# Altium schematic sheet 1_AIR_TEST.schdoc
size 309 x 223 mm; Symbol: Sheet-Symbol_A4; Device: Sheet-Symbol_A4; @Page Name: P1; @Create Date: 2023-04-03; @Page Count: 2; @Page No: 1; @Project Name: AIR_TestSys Design_2023-04-03_20-42-52; @Schematic Name: Schematic1; @Update Date: 2023-05-18; Company: 嘉立创EDA; Page Size: A4; Version: V1.0
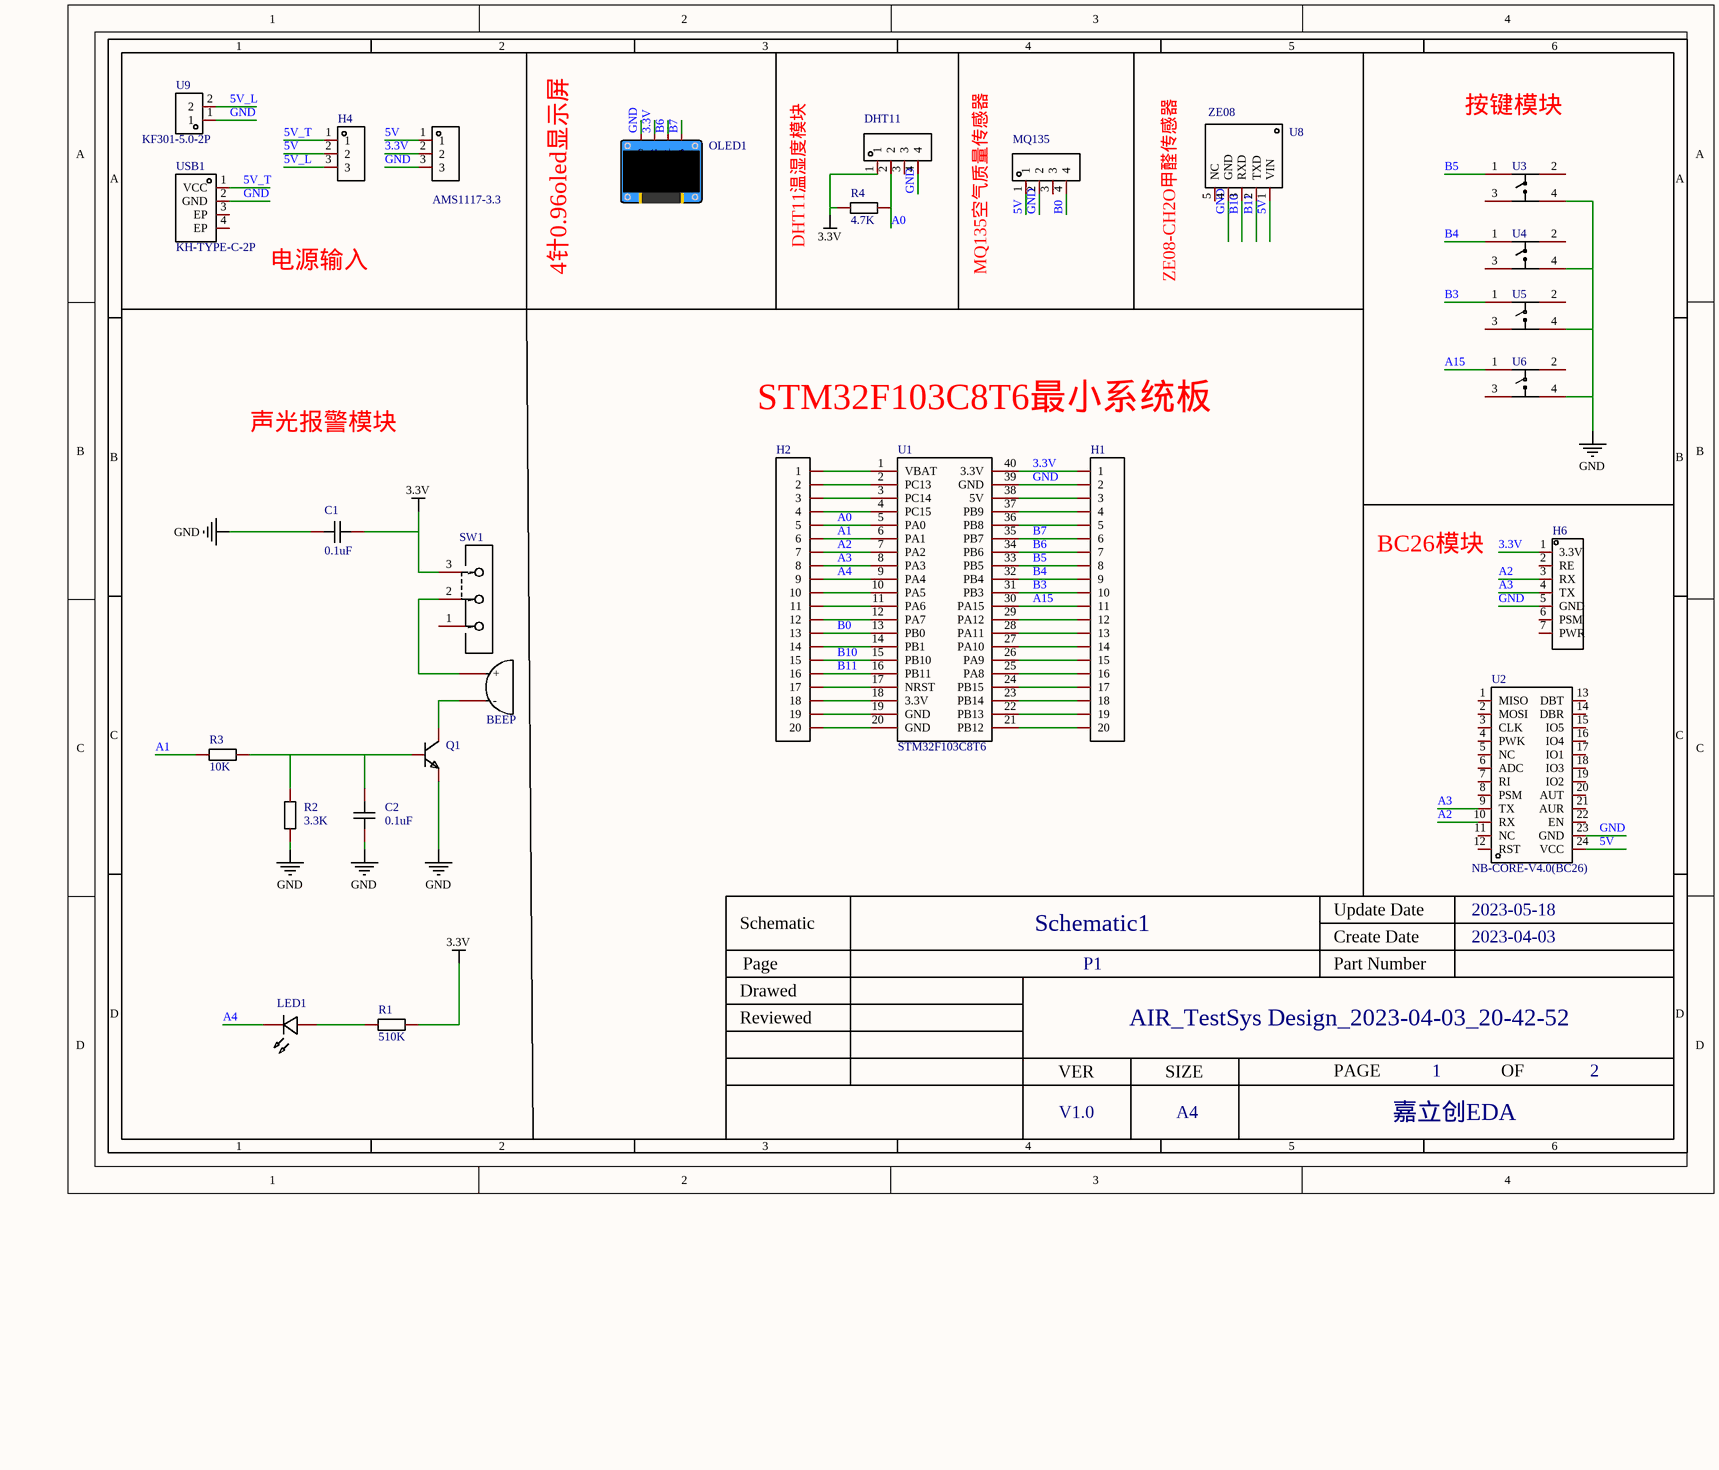
[diagram p0: 1_AIR_TEST.schdoc]

## Parts
BEEP1  BEEP  [SOT12-7.6]
C1  0.1uF  [C0603]
C2  0.1uF  [C0603]
DHT11  HDR-F_2.54_1x4P  [HDR-TH_4P-P2.54-V-F]  (value not drawn)
H1  HDR-F_2.54_1x20P  [HDR-TH_20P-P2.54-V-F]  (value not drawn)
H2  HDR-F_2.54_1x20P  [HDR-TH_20P-P2.54-V-F]  (value not drawn)
H4  HDR-F_2.54_1x3P  [HDR-TH_3P-P2.54-V-F]  (value not drawn)
H6  HDR-F_2.54_1x7P  [HDR-TH_7P-P2.54-V-F]  (value not drawn)
LED1  LED_TH-R_3mm  [LED_TH-3mm]  (value not drawn)
MQ135  HDR-F_2.54_1x4P  [HDR-TH_4P-P2.54-V-F]  (value not drawn)
OLED1  0.96OLED模块_4P  [0.96OLED_4P]  (value not drawn)
Q1  S8050_TO_NPN  [S8050_TO_92]  (value not drawn)
R1  510K  [R0603]
R2  3.3K  [R0603]
R3  10K  [R0603]
R4  4.7K  [R0603]
SW1  ss-12d00-g4拨动开关  [3脚拨动开关SS-12D00-G4]  (value not drawn)
U1  STM32F103C8T6  [STM32F103C8T6最小系统模块]
U2  NB-CORE-V4.0(BC26)
U3  四角按键  [SW-SMD_4P-L6.0-W6.0-P4.50-LS9.2]  (value not drawn)
U4  四角按键  [SW-SMD_4P-L6.0-W6.0-P4.50-LS9.2]  (value not drawn)
U5  四角按键  [SW-SMD_4P-L6.0-W6.0-P4.50-LS9.2]  (value not drawn)
U6  四角按键  [SW-SMD_4P-L6.0-W6.0-P4.50-LS9.2]  (value not drawn)
U7  AMS1117-3.3  [HDR-TH_3P-P2.54-V-F]
U8  ZE08  [ZE08B]
U9  KF301-5.0-2P  [CONN-TH_P5.00_KF301-5.0-2P]
USB1  KH-TYPE-C-2P  [USB-SMD_KH-TYPE-C-2P]

## Nets
3.3V: C1.2 DHT11.1 H1.1 H6.1(3.3V) OLED1.2(VCC) R1.2 R4.1 SW1.3 U1.40(3.3V) U7.2
GND: C1.1 C2.1 DHT11.4 H1.2 H6.5(GND) MQ135.2 OLED1.1(GND) Q1.1(E) R2.1 U1.39(GND) U2.23(GND) U3.4 U4.4 U5.4 U6.4 U7.3 U8.4(GND) U9.1 USB1.2(GND)
5V: H4.2 MQ135.1 U2.24(VCC) U7.1 U8.1(VIN)
5V_L: H4.3 U9.2
5V_T: H4.1 USB1.1(VCC)
A0: DHT11.2 H2.5 R4.2 U1.5(PA0)
A1: H2.6 R3.1 U1.6(PA1)
A2: H2.7 H6.3(RX) U1.7(PA2) U2.10(RX)
A3: H2.8 H6.4(TX) U1.8(PA3) U2.9(TX)
A4: H2.9 LED1.2(A) U1.9(PA4)
A15: H1.11 U1.30(PA15) U6.1
B0: H2.13 MQ135.4 U1.13(PB0)
B3: H1.10 U1.31(PB3) U5.1
B4: H1.9 U1.32(PB4) U4.1
B5: H1.8 U1.33(PB5) U3.1
B6: H1.7 OLED1.3(SCL) U1.34(PB6)
B7: H1.6 OLED1.4(SDA) U1.35(PB7)
B10: H2.15 U1.15(PB10) U8.3(RXD)
B11: H2.16 U1.16(PB11) U8.2(TXD)
NetBEEP1_1: BEEP1.1(+) SW1.2
NetBEEP1_2: BEEP1.2(-) Q1.3(C)
NetC2_2: C2.2 Q1.2(B) R2.2 R3.2
NetH1_3: H1.3 U1.38(5V)
NetH1_4: H1.4 U1.37(PB9)
NetH1_5: H1.5 U1.36(PB8)
NetH1_12: H1.12 U1.29(PA12)
NetH1_13: H1.13 U1.28(PA11)
NetH1_14: H1.14 U1.27(PA10)
NetH1_15: H1.15 U1.26(PA9)
NetH1_16: H1.16 U1.25(PA8)
NetH1_17: H1.17 U1.24(PB15)
NetH1_18: H1.18 U1.23(PB14)
NetH1_19: H1.19 U1.22(PB13)
NetH1_20: H1.20 U1.21(PB12)
NetH2_1: H2.1 U1.1(VBAT)
NetH2_2: H2.2 U1.2(PC13)
NetH2_3: H2.3 U1.3(PC14)
NetH2_4: H2.4 U1.4(PC15)
NetH2_10: H2.10 U1.10(PA5)
NetH2_11: H2.11 U1.11(PA6)
NetH2_12: H2.12 U1.12(PA7)
NetH2_14: H2.14 U1.14(PB1)
NetH2_17: H2.17 U1.17(NRST)
NetH2_18: H2.18 U1.18(3.3V)
NetH2_19: H2.19 U1.19(GND)
NetH2_20: H2.20 U1.20(GND)
NetLED1_1: LED1.1(C) R1.1

Not connected (* = marked no-connect by the designer): DHT11 3; H6 2(RE) 6(PSM) 7(PWR); MQ135 3; SW1 1; U2 1(MISO) 2(MOSI) 3(CLK) 4(PWK) 5(NC) 6(ADC) 7(RI) 8(PSM) 11(NC) 12(RST) 13(DBT) 14(DBR) 15(IO5) 16(IO4) 17(IO1) 18(IO3) 19(IO2) 20(AUT) 21(AUR) 22(EN); U3 2 3; U4 2 3; U5 2 3; U6 2 3; U8 5(NC); USB1 3(EP) 4(EP)

## Notes on the sheet
- 按键模块
- 电源输入
- 4针0.96oled显示屏
- (near R4) DHT11温湿度模块
- MQ135空气质量传感器
- (near U8) ZE08-CH2O甲醛传感器
- STM32F103C8T6最小系统板
- 声光报警模块
- BC26模块
- 1
- 2
- 3
- 4
- 5
- 6
- A
- B
- C
- Schematic
- Schematic1
- Create Date
- Update Date
- 2023-04-03
- 2023-05-18
- D
- Reviewed
- Drawed
- Page
- P1
- Part Number
- AIR_TestSys Design_2023-04-03_20-42-52
- VER
- SIZE
- PAGE
- OF
- V1.0
- A4
- 嘉立创EDA

## Library data of the parts
BEEP1 = BEEP: Add into BOM: yes; Name: BEEP; Symbol: BEEP; Device: BEEP; Convert to PCB: yes; JLCPCB Part Class: 扩展库
C1 C2 = CAP_0603: Symbol: CapAcitance; Convert to PCB: yes; Name: 0.1uF; Device: CAP_0603; Add into BOM: yes; Supplier Footprint: 0603; Value: 0.1uF
DHT11 MQ135 = HDR-F_2.54_1x4P: Symbol: 2.54-1*4P母; Convert to PCB: yes; Device: HDR-F_2.54_1x4P; Add into BOM: yes; Supplier Part: C2718488; Supplier Footprint: 插件; NO_CONNECT: yes
H1 H2 = HDR-F_2.54_1x20P: Convert to PCB: yes; Symbol: HDR-F_2.54_1x20P; Device: HDR-F_2.54_1x20P; Add into BOM: yes; Supplier Part: C50984; Supplier Footprint: 插件
H4 U7 = HDR-F_2.54_1x3P: Symbol: PM254V-11-03-H85; Convert to PCB: yes; Device: HDR-F_2.54_1x3P; Add into BOM: yes; Supplier Part: C541850; Supplier Footprint: 插件
  U7: Name: AMS1117-3.3
H6 = HDR-F_2.54_1x7P: Symbol: 220S-1*7P H=8.5MM Ytype Gold-plated; Convert to PCB: yes; Device: HDR-F_2.54_1x7P; Add into BOM: yes; Supplier Part: C124418; Supplier Footprint: 插件; NO_CONNECT: yes
LED1 = LED_TH-R_3mm: Convert to PCB: yes; Symbol: LED_TH-R; Device: LED_TH-R_3mm; Add into BOM: yes; Supplier Footprint: 插件
OLED1 = 0.96OLED模块_4P: Convert to PCB: yes; Symbol: 0.96OLED模块_4P; Device: 0.96OLED模块_4P; Add into BOM: yes; Supplier Footprint: 插件
Q1 = S8050_TO_NPN: Convert to PCB: yes; Symbol: S8050_TO_NPN; Device: S8050_TO_NPN; Add into BOM: yes; Supplier Footprint: TO-92
R1-R4 = Res_0603: Symbol: 电阻; Convert to PCB: yes; Device: Res_0603; Add into BOM: yes; Supplier Footprint: 0603
  R1: Name: 510K; Value: 510K
  R2: Name: 3.3K; Value: 3.3K
  R3: Name: 10K; Value: 10K
  R4: Name: 4.7K; Value: 4.7K
SW1 = ss-12d00-g4拨动开关: Pin Type: IN; Add into BOM: yes; Symbol: ss-12d00-g4拨动开关; Device: ss-12d00-g4拨动开关; Manufacturer Part: SS-12d00-G4; Convert to PCB: yes; NO_CONNECT: yes
U1 = STM32F103C8T6: Manufacturer: 无; Add into BOM: yes; tags: STM32; Name: STM32F103C8T6; Symbol: STM32F103C8T6; Device: STM32F103C8T6; Convert to PCB: yes; Supplier Part: C8734; Manufacturer Part: STM32F103C8T6最小系统模块; image: http://image.lceda.cn/szlcsc/C8734.jpg; 3DModel: STM32F103C8T6
U2 = NB-CORE-V4.0(BC26): Add into BOM: yes; _: 3; Name: NB-CORE-V4.0(BC26); Symbol: NB-CORE-V4.0(BC26); Device: NB-CORE-V4.0(BC26); Convert to PCB: yes; Supplier: 创思通信; link: https://item.taobao.com/item.htm?spm=a1z09.2.0.0.1c802e8dn9SLJy&id=681907643242&_u=p2f5rhld6cee; NO_CONNECT: yes
U3-U6 = 四角按键: Add into BOM: yes; Symbol: 四角按键; Device: 四角按键; LCSC Part Name: 四角按键; Supplier Part: C9900012348; Manufacturer Part: 四角按键; Supplier Footprint: SW-PB; JLCPCB Part Class: Extended Part; Datasheet: https://atta.szlcsc.comnull; Supplier: LCSC; Convert to PCB: yes; NO_CONNECT: yes
U8 = ZE08B: Convert to PCB: yes; Name: ZE08; Symbol: ZE08B; Device: ZE08B; Add into BOM: yes; JLCPCB Part Class: 扩展库; NO_CONNECT: yes
U9 = KF301-5.0-2P: Manufacturer: Cixi Kefa Elec; Add into BOM: yes; Name: KF301-5.0-2P; Symbol: KF301-5.0-2P; Device: KF301-5.0-2P; Convert to PCB: yes; link: https://item.szlcsc.com/481499.html; 3DModel: CONN-TH_P5.00_KF301-5.0-2P; Supplier: LCSC; Supplier Part: C474881; Manufacturer Part: KF301-5.0-2P; JLCPCB Part Class: Extended Part
USB1 = KH-TYPE-C-2P: 连接器类型:Type-C;标准:-;公母:母座;触点数量:2;端口数量:1;安装方式:弯插;额定电流 - 电源:-;工作温度范围:-25℃~+85℃;; Manufacturer: kinghelm(金航标); Add into BOM: yes; Connector Type: Type-C; Gender: 母座; Number of Contacts: 2; Number of Ports: 1; Name: KH-TYPE-C-2P; Symbol: KH-TYPE-C-2P; Device: KH-TYPE-C-2P; Convert to PCB: yes; LCSC Part Name: Type-C 母座 弯插; Supplier Part: C2919656; Manufacturer Part: KH-TYPE-C-2P; Supplier Footprint: 插件; JLCPCB Part Class: 扩展库; Datasheet: https://atta.szlcsc.com/upload/public/pdf/source/20220707/620587A9E0589B27D96D3CEE595CBC98.pdf; Supplier: LCSC; Standard: -; Mounting Style: 弯插; Current Rating - Power (Max): -; Operating Temperature Range: -25℃~+85℃; NO_CONNECT: yes